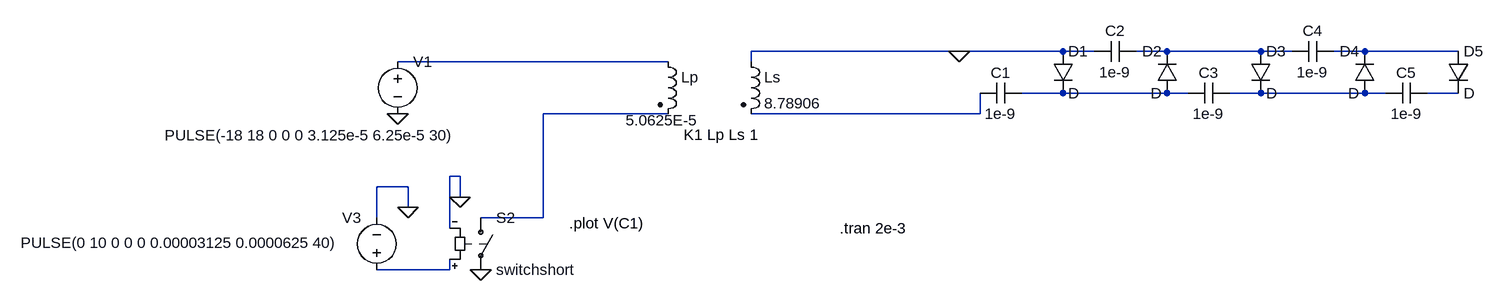
[diagram p0: schematic VillardCascadingModel1.asc]
VillardCascadingModel1.asc, the LTspice schematic file:
Version 4
SHEET 1 880 680
WIRE -240 48 -560 48
WIRE -80 48 -240 48
WIRE -32 48 -80 48
WIRE 80 48 32 48
WIRE 224 48 80 48
WIRE 272 48 224 48
WIRE 384 48 336 48
WIRE 528 48 384 48
WIRE -688 64 -1104 64
WIRE -560 64 -560 48
WIRE -80 112 -144 112
WIRE 80 112 -80 112
WIRE 112 112 80 112
WIRE 224 112 176 112
WIRE 384 112 224 112
WIRE 416 112 384 112
WIRE 528 112 480 112
WIRE -688 144 -880 144
WIRE -208 144 -208 112
WIRE -208 144 -560 144
WIRE -1008 240 -1024 240
WIRE -1088 256 -1136 256
WIRE -1008 272 -1008 240
WIRE -1088 288 -1088 256
WIRE -1136 304 -1136 256
WIRE -880 304 -880 144
WIRE -880 304 -976 304
WIRE -1024 320 -1024 240
WIRE -1024 384 -1024 368
WIRE -1024 384 -1136 384
FLAG -240 48 0
FLAG -1088 288 0
FLAG -1008 272 0
FLAG -976 384 0
FLAG -1104 144 0
SYMBOL diode -96 48 R0
SYMATTR InstName D1
SYMBOL diode 96 112 R180
WINDOW 0 24 64 Left 2
WINDOW 3 24 0 Left 2
SYMATTR InstName D2
SYMBOL diode 208 48 R0
SYMATTR InstName D3
SYMBOL diode 400 112 R180
WINDOW 0 24 64 Left 2
WINDOW 3 24 0 Left 2
SYMATTR InstName D4
SYMBOL cap -144 96 R90
WINDOW 0 0 32 VBottom 2
WINDOW 3 32 32 VTop 2
SYMATTR InstName C1
SYMATTR Value 1e-9
SYMBOL cap 32 32 R90
WINDOW 0 0 32 VBottom 2
WINDOW 3 32 32 VTop 2
SYMATTR InstName C2
SYMATTR Value 1e-9
SYMBOL cap 176 96 R90
WINDOW 0 0 32 VBottom 2
WINDOW 3 32 32 VTop 2
SYMATTR InstName C3
SYMATTR Value 1e-9
SYMBOL cap 336 32 R90
WINDOW 0 0 32 VBottom 2
WINDOW 3 32 32 VTop 2
SYMATTR InstName C4
SYMATTR Value 1e-9
SYMBOL voltage -1104 48 R0
WINDOW 123 0 0 Left 0
WINDOW 39 0 0 Left 0
WINDOW 3 -358 129 Left 2
SYMATTR InstName V1
SYMATTR Value PULSE(-18 18 0 0 0 3.125e-5 6.25e-5 30)
SYMBOL cap 480 96 R90
WINDOW 0 0 32 VBottom 2
WINDOW 3 32 32 VTop 2
SYMATTR InstName C5
SYMATTR Value 1e-9
SYMBOL diode 512 48 R0
SYMATTR InstName D5
SYMBOL ind2 -704 48 R0
WINDOW 3 -49 106 Left 2
SYMATTR InstName Lp
SYMATTR Value 5.0625E-5
SYMATTR Type ind
SYMBOL ind2 -576 48 R0
SYMATTR InstName Ls
SYMATTR Value 8.78906
SYMATTR Type ind
SYMBOL sw -976 288 R0
SYMATTR InstName S2
SYMATTR Value switchshort
SYMBOL voltage -1136 400 R180
WINDOW 0 24 96 Left 2
WINDOW 3 55 58 Left 2
WINDOW 123 0 0 Left 0
WINDOW 39 0 0 Left 0
SYMATTR InstName V3
SYMATTR Value PULSE(0 10 0 0 0 0.00003125 0.0000625 40)
TEXT -424 320 Left 2 !.tran 2e-3
TEXT -840 312 Left 2 !.plot V(C1)
TEXT -664 176 Left 2 !K1 Lp Ls 1

The netlist it stands for:
* VillardCascadingModel1.asc
D1 0 N004 D
D2 N004 N001 D
D3 N001 N005 D
D4 N005 N002 D
C1 N004 N008 1e-9
C2 N001 0 1e-9
C3 N005 N004 1e-9
C4 N002 N001 1e-9
V1 N003 0 PULSE(-18 18 0 0 0 3.125e-5 6.25e-5 30)
C5 N006 N005 1e-9
D5 N002 N006 D
Lp N003 N007 5.0625E-5
Ls 0 N008 8.78906
S2 N007 0 N009 0 switchshort
V3 N009 0 PULSE(0 10 0 0 0 0.00003125 0.0000625 40)
.model D D
.lib standard.dio
.tran 2e-3
.plot V(C1)
K1 Lp Ls 1
.backanno
.end